# Altium schematic sheet Connectors.SchDoc: Connectors
size A4; Date: Not used; ApprovedBy: Not used; CheckedBy: Not used; Author: Not used; CompanyName: STMicroelectronics; DrawnBy: Not used; Engineer: Not used; Organization: Not used; Address1: Not used; Address2: Not used; Address3: Not used; Address4: Not used; DocumentNumber: Not used; Revision: Not used; SheetNumber: 6; SheetTotal: 6; CurrentTime: Not used; CurrentDate: Not used; Time: Not used; DocumentFullPathAndName: Not used; DocumentName: Not used; ModifiedDate: Not used; ImagePath: Not used; ProjectName: Not used; Application_BuildNumber: Not used
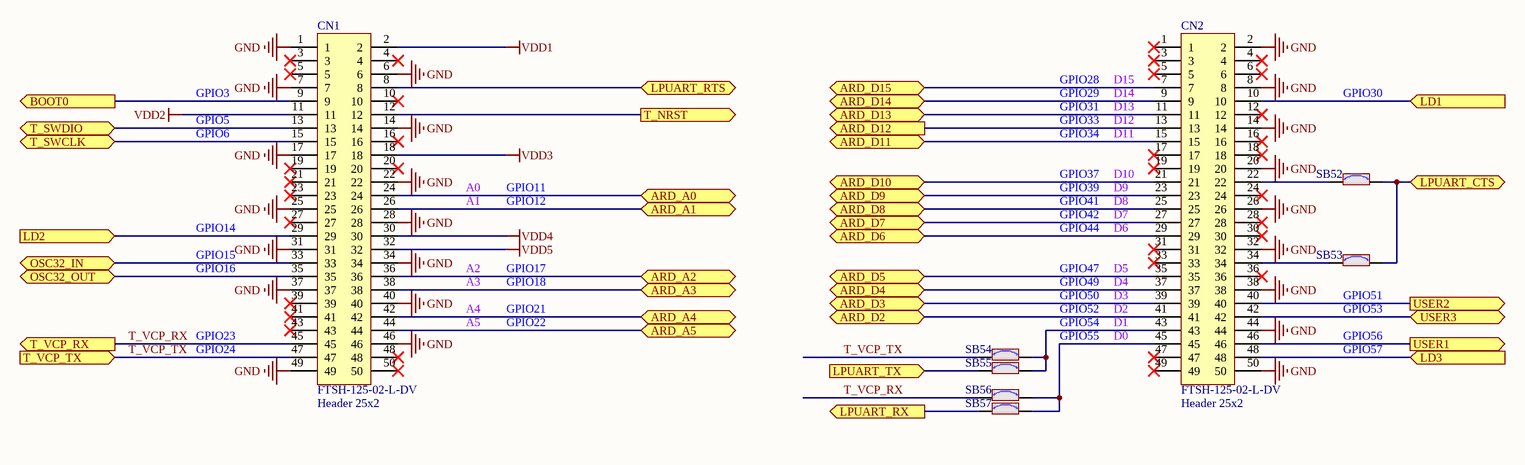
[diagram p0: Connectors.SchDoc]

## Parts
CN1  FTSH-125-02-L-DV  value Header 25x2  [CON_SAMTEC_FTSH-125-02-L-DV]
CN2  FTSH-125-02-L-DV  value Header 25x2  [CON_SAMTEC_FTSH-125-02-L-DV]
SB52  SB_ON  [SOLDER-BRIDGE_R0402-0R]  (value not drawn)
SB53  SB_ON  [SOLDER-BRIDGE_R0402-0R]  (value not drawn)
SB54  SB_ON  [SOLDER-BRIDGE_R0402-0R]  (value not drawn)
SB55  SB_ON  [SOLDER-BRIDGE_R0402-0R]  (value not drawn)
SB56  SB_ON  [SOLDER-BRIDGE_R0402-0R]  (value not drawn)
SB57  SB_ON  [SOLDER-BRIDGE_R0402-0R]  (value not drawn)

## Ports
ARD_A0 (bidir), ARD_A1 (bidir), ARD_A2 (bidir), ARD_A3 (bidir), ARD_A4 (bidir), ARD_A5 (bidir), ARD_D2 (bidir), ARD_D3 (bidir), ARD_D4 (bidir), ARD_D5 (bidir), ARD_D6 (bidir), ARD_D7 (bidir), ARD_D8 (bidir), ARD_D9 (bidir), ARD_D10 (bidir), ARD_D11 (bidir), ARD_D12 (out), ARD_D13 (bidir), ARD_D14 (bidir), ARD_D15 (bidir), BOOT0 (out), LD1 (in), LD2 (in), LD3 (in), LPUART_CTS (bidir), LPUART_RTS (bidir), LPUART_RX (out), LPUART_TX (in), OSC32_IN (bidir), OSC32_OUT (bidir), T_NRST (out), T_SWCLK (bidir), T_SWDIO (bidir), T_VCP_RX (out), T_VCP_TX (in), USER1 (out), USER2 (out), USER3 (bidir)

## Nets
GND: CN1.1 CN1.6 CN1.7 CN1.14 CN1.17 CN1.22 CN1.25 CN1.28 CN1.31 CN1.34 CN1.37 CN1.40 CN1.46 CN1.49 CN2.2 CN2.8 CN2.14 CN2.20 CN2.26 CN2.32 CN2.38 CN2.44 CN2.50
VDD1: CN1.2
VDD2: CN1.11
VDD3: CN1.18
VDD4: CN1.30
VDD5: CN1.32
ARD_A0: CN1.24 ; port ARD_A0
ARD_A1: CN1.26 ; port ARD_A1
ARD_A2: CN1.36 ; port ARD_A2
ARD_A3: CN1.38 ; port ARD_A3
ARD_A4: CN1.42 ; port ARD_A4
ARD_A5: CN1.44 ; port ARD_A5
ARD_D2: CN2.41 ; port ARD_D2
ARD_D3: CN2.39 ; port ARD_D3
ARD_D4: CN2.37 ; port ARD_D4
ARD_D5: CN2.35 ; port ARD_D5
ARD_D6: CN2.29 ; port ARD_D6
ARD_D7: CN2.27 ; port ARD_D7
ARD_D8: CN2.25 ; port ARD_D8
ARD_D9: CN2.23 ; port ARD_D9
ARD_D10: CN2.21 ; port ARD_D10
ARD_D11: CN2.15 ; port ARD_D11
ARD_D12: CN2.13 ; port ARD_D12
ARD_D13: CN2.11 ; port ARD_D13
ARD_D14: CN2.9 ; port ARD_D14
ARD_D15: CN2.7 ; port ARD_D15
BOOT0: CN1.9 ; port BOOT0
LD1: CN2.10 ; port LD1
LD2: CN1.29 ; port LD2
LD3: CN2.48 ; port LD3
LPUART_CTS: SB52.2 SB53.2 ; port LPUART_CTS
LPUART_RTS: CN1.8 ; port LPUART_RTS
LPUART_RX: SB57.1 ; port LPUART_RX
LPUART_TX: SB55.1 ; port LPUART_TX
OSC32_IN: CN1.33 ; port OSC32_IN
OSC32_OUT: CN1.35 ; port OSC32_OUT
T_NRST: CN1.12 ; port T_NRST
T_SWCLK: CN1.15 ; port T_SWCLK
T_SWDIO: CN1.13 ; port T_SWDIO
T_VCP_RX: CN1.45 SB56.1 ; port T_VCP_RX
T_VCP_TX: CN1.47 SB54.1 ; port T_VCP_TX
USER1: CN2.46 ; port USER1
USER2: CN2.40 ; port USER2
USER3: CN2.42 ; port USER3
NetCN2_22: CN2.22 SB52.1
NetCN2_34: CN2.34 SB53.1
NetCN2_43: CN2.43 SB54.2 SB55.2
NetCN2_45: CN2.45 SB56.2 SB57.2

Not connected (* = marked no-connect by the designer): CN1 3* 4* 5* 10* 16* 19* 20* 21* 23* 27* 39* 41* 43* 48* 50*; CN2 1* 3* 4* 5* 6* 12* 16* 17* 18* 19* 24* 28* 30* 31* 33* 36* 47* 49*

## Notes on the sheet
- GPIO3
- GPIO5
- GPIO28
- GPIO29
- GPIO31
- GPIO33
- (near CN2) D12
- (near CN2) D13
- (near CN2) D14
- (near CN2) D15
- GPIO30
- GPIO6
- A0
- GPIO11
- GPIO34
- GPIO37
- GPIO39
- D9
- (near CN2) D10
- (near CN2) D11
- GPIO14
- GPIO15
- A1
- GPIO12
- GPIO41
- GPIO42
- GPIO44
- D8
- D7
- D6
- GPIO16
- A2
- A3
- A4
- A5
- GPIO17
- GPIO18
- GPIO21
- GPIO22
- GPIO54
- GPIO52
- GPIO47
- GPIO49
- GPIO50
- D1
- D2
- D5
- D4
- D3
- (near SB53) GPIO51
- (near SB53) GPIO53
- GPIO23
- GPIO24
- GPIO55
- D0
- GPIO56
- GPIO57
- Title:
- Project:
- Size:
- Revision:
- Variant:
- -
- Date:
- Reference:
- Sheet:
- of

## Library data of the parts
CN1 CN2 = MCD-02746: Header, 25x2, 12.7mm, VR, SMD, T=4.83mm; Part_Type: Connector; Part_Preference: Recommended; Manufacturer: SAMTEC; Component_Country_Of_Origin: China, Costa Rica, Malaysia, USA, Vietnam; ShowFields: YES; ID: 4858; ComponentLink1URL: http://tunmcdsvn.tun.st.com/Component_Documentation_Library/Trunk/Connector/SAMTEC_FTSH_Series; Internal_Part_Number: MCD-02746; Status: Checked; Manufacturer_Part_Number: FTSH-125-02-L-DV; Order_Code_Digikey: FTSH-125-02-L-DV-ND; Order_Code_Farnell: 3751075; Order_Code_RS: N/A
SB52-SB57 = MCD-01618: Solder Bridge 0402 ON; Part_Type: Resistor; Part_Preference: Recommended; Manufacturer: YAGEO; Manufacturer_Part_Number: RC0402JR-070RL; Value: 0R; Order_Code_RS: 618-5804; Component_Country_Of_Origin: China; ShowFields: YES; ID: 3718; Internal_Part_Number: MCD-01618; Status: Released; Package: 0402; ComponentLink1URL: http://tunmcdsvn.tun.st.com/Component_Documentation_Library/Trunk/Resistor/YAGEO_RC0402_Series; Order_Code_Digikey: 311-0.0JRTR-ND; Order_Code_Farnell: 2363467